# EAGLE design sensores (EAGLE 9.0.0)
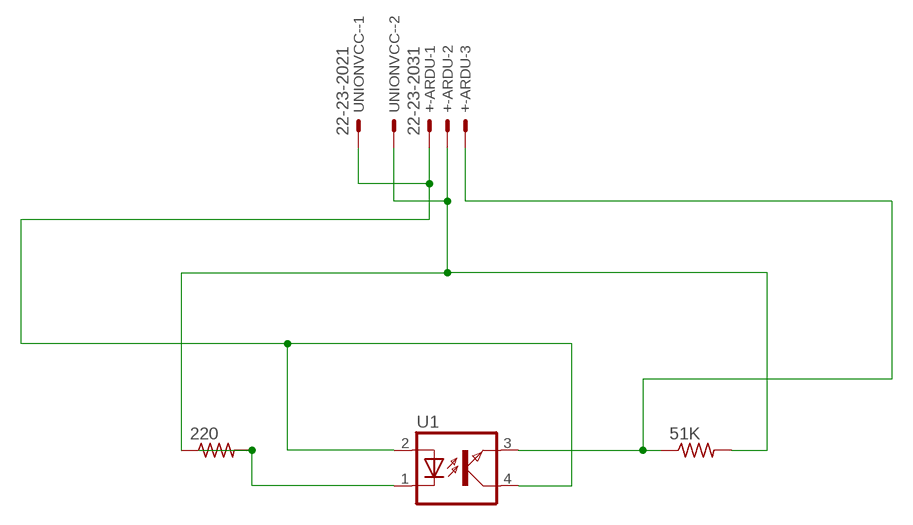
[diagram p0: schematic, sheet 1]

## Parts
51K  R-US_0207/10  [0207/10]
220  R-US_0207/10  [0207/10]
+-ARDU  22-23-2031  [22-23-2031]
U1  CNY70  [CNY70]
UNIONVCC-  22-23-2021  [22-23-2021]

## Nets
N$1: 220.2 U1.1
N$5: 51K.1 +-ARDU.3 U1.3
N$9: 51K.2 220.1 +-ARDU.2 UNIONVCC-.2
N$11: +-ARDU.1 U1.2 U1.4 UNIONVCC-.1

## Library data of the parts
51K 220 = rcl:R-US_: RESISTOR, American symbol; SPICEPREFIX: R
+-ARDU = con-molex:22-23-2031: .100" (2.54mm) Center Header - 3 Pin; MF: MOLEX; MPN: 22-23-2031; OC_FARNELL: 1462950; OC_NEWARK: 30C0862
U1 = E&R_Sensores:CNY70: Sensor infrarrojo CNY70
UNIONVCC- = con-molex:22-23-2021: .100" (2.54mm) Center Header - 2 Pin; MF: MOLEX; MPN: 22-23-2021; OC_FARNELL: 1462926; OC_NEWARK: 25C3832

## Board
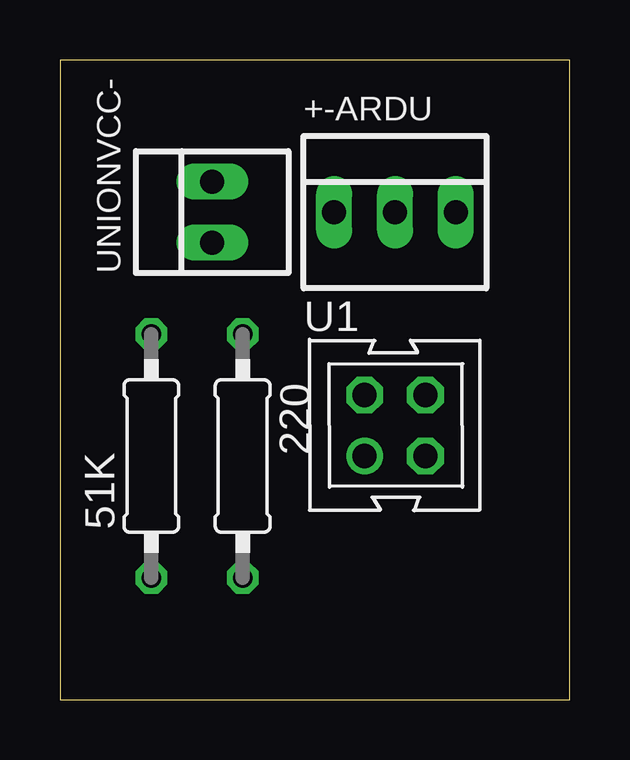
[diagram p1: board, top side]
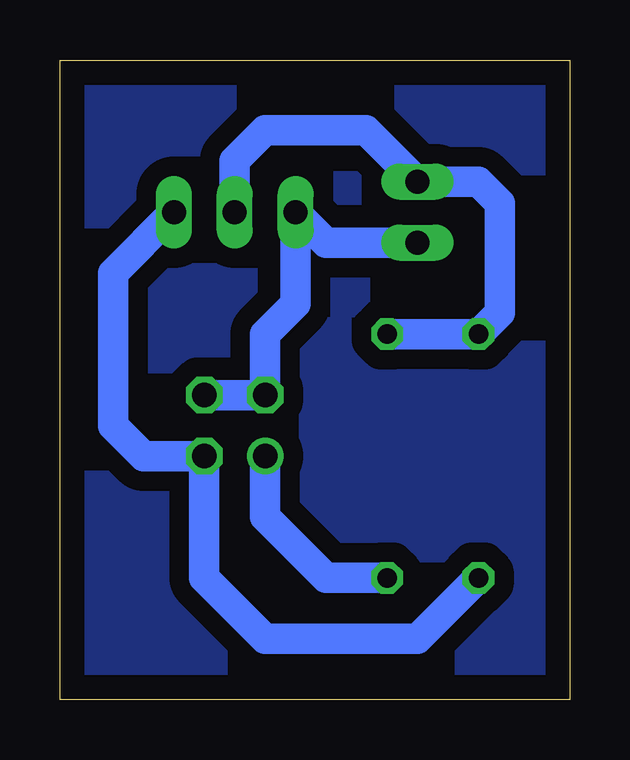
[diagram p2: board, bottom side, seen from below]

Size 21.26 x 26.66 mm. Coordinates in mm from the lower left corner, seen from the top.
Outline: 0,0 21.26,0 21.26,26.66 0,26.66 0,0
Copper layers (1*16): Top 0.035mm / dielectric 1.5mm / Bottom 0.035mm
Design rules "default": minimum track width 6mil, minimum drill 0.35mm, track to track 6mil, track to pad 6mil, pad to pad 6mil, via to via 6mil, smd to smd 6mil, copper to edge 40mil, drill to drill 6mil, minimum pad ring 10mil, minimum via ring 8mil, stop-mask expansion 4mil, vias tented up to drill 0mil, thermal gap 10mil

### Footprints (pad centres in the part's own frame; a part is rotated, then mirrored left to right if it is on the bottom)
0207/10 = drill 0.813 octagon: 1 -5.08,0; 2 5.08,0
22-23-2031 = drill 1 long: 1 -2.54,0; 2 0,0; 3 2.54,0
CNY70 = drill 1.016: 1 -2.54,-1.27 | drill 1.016 octagon: 2 -2.54,1.27; 3 0,-1.27; 4 0,1.27
22-23-2021 = drill 1 long: 1 -1.27,0; 2 1.27,0

### Placement (x,y rotation side)
51K  3.81,10.16 90 top
220  7.62,10.16 270 top
+-ARDU  13.97,20.32 0 top
U1  15.24,11.43 0 top
UNIONVCC-  6.35,20.32 90 top

### Tracks (layer width: path | path; a pad name or v marks a point on that pad's centre or on a via)
N$1
  Bottom 1.27: 220.2 10.16,5.08 12.7,7.62 U1.1
N$2
  pour Bottom (isolate 0.813): 0,0 0,26.67 21.59,26.67 21.59,0
N$5
  Bottom 1.27: 51K.1 6.35,2.54 12.7,2.54 15.24,5.08 U1.3 17.78,10.16 19.05,11.43 19.05,17.78 +-ARDU.3
N$9
  Bottom 1.27: +-ARDU.2 13.97,22.47 12.7,23.74 8.5,23.74 UNIONVCC-.2 3.81,21.59 2.92,20.7 2.92,16.13 51K.2 220.1
N$11
  Bottom 1.27: UNIONVCC-.1 10.16,19.05 +-ARDU.1 11.43,16.51 12.7,15.24 U1.2 U1.4